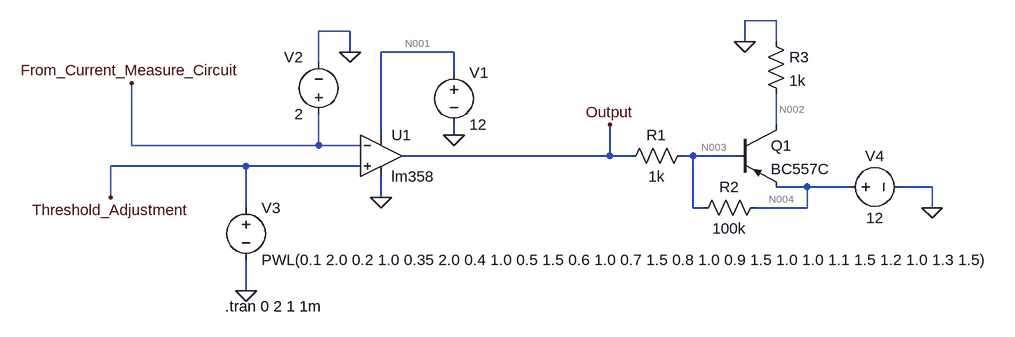
[diagram p0: schematic Cur_lm.asc]
* Cur_lm.asc
* U1: lm358 (symbol myLib\lm358 not available, pins judged from their places): In+=Threshold_Adjustment In-=From_Current_Measure_Circuit V+=N001 V-=0 OUT=Output
V1 N001 0 12
V2 From_Current_Measure_Circuit 0 2
V3 Threshold_Adjustment 0 PWL(0.1 2.0 0.2 1.0 0.35 2.0 0.4 1.0 0.5 1.5 0.6 1.0 0.7 1.5 0.8 1.0 0.9 1.5 1.0 1.0 1.1 1.5 1.2 1.0 1.3 1.5)
Q1 N002 N003 N004 0 BC557C
R1 N003 Output 1k
V4 N004 0 12
R2 N004 N003 100k
R3 0 N002 1k
.model NPN NPN
.model PNP PNP
.lib standard.bjt
.tran 0 2 1 1m
.backanno
.end

* Results of the author's LTspice run, read from the files saved beside the schematic
* Operating Point, zero values left out:
*   V(from_current_measure_circuit) = 2 V
*   V(threshold_adjustment) = 2 V
*   V(n001) = 12 V
*   V(output) = 10.98 V
*   V(n002) = 11.94 V
*   V(n003) = 11.3 V
*   V(n004) = 12 V
*   Ic(Q1) = -11.94 mA
*   Ib(Q1) = -310.9 µA
*   Ie(Q1) = 12.25 mA
*   I(R3) = -11.94 mA
*   I(R2) = 7.013 µA
*   I(R1) = 317.9 µA
*   I(V4) = -12.25 mA
*   I(V3) = 48.42 nA
*   I(V2) = 41.51 nA
*   I(V1) = 21.42 µA
*   Ix(u1:1) = -48.42 nA
*   Ix(u1:2) = -41.51 nA
*   Ix(u1:99) = -21.42 µA
*   Ix(u1:50) = -296.4 µA
*   Ix(u1:28) = 317.9 µA
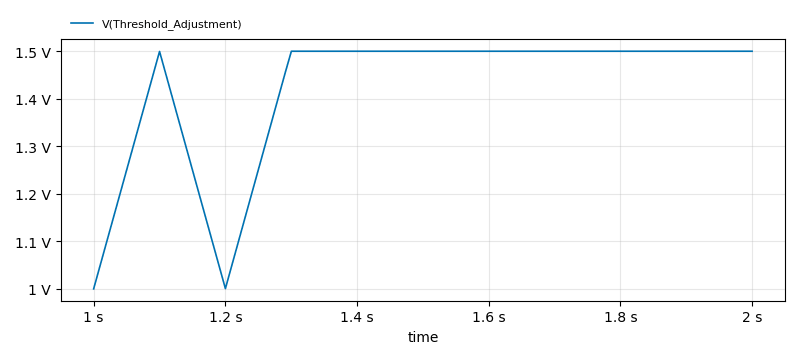
[diagram p1: Transient Analysis of Cur_lm.asc, plotted from the saved traces]
* Transient Analysis, 1 run:
*   V(Threshold_Adjustment): min 1 V, max 1.5 V, average 1.425 V, rms 1.436 V, last 1.5 V